# Altium project Midi Stick.PrjPCB
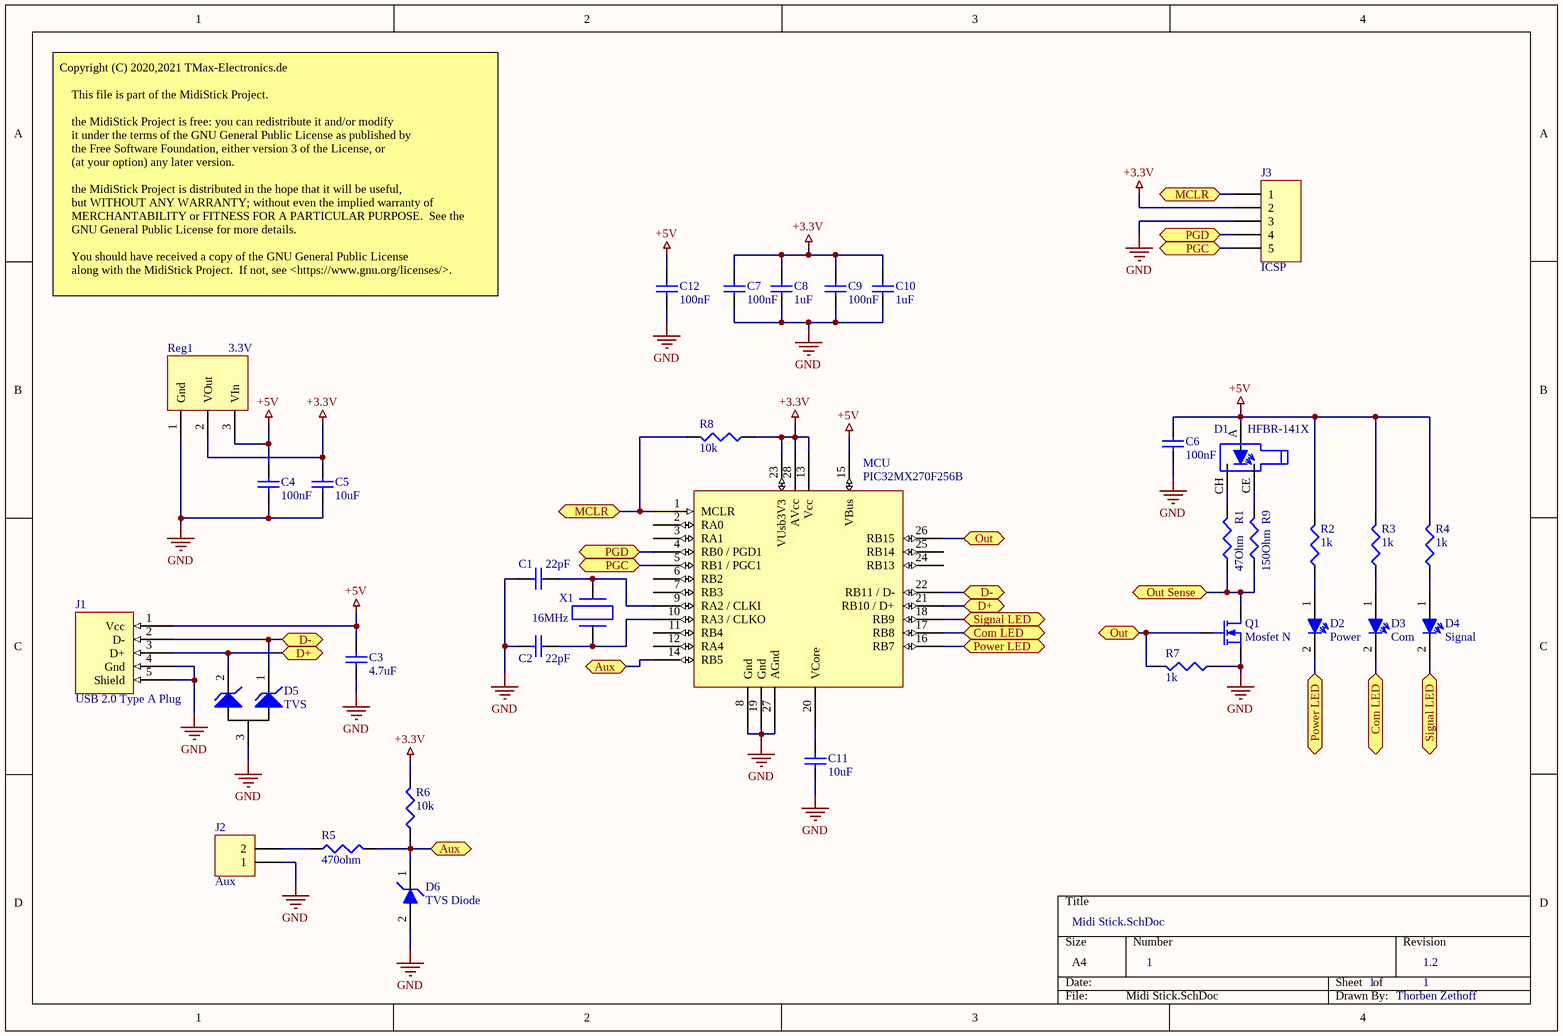
[diagram p0: Midi Stick.SchDoc]
Version: 1.2; Manager: Thorben Zethoff
1 sheet, 34 parts. Net scope: flat (ports and power ports of the same name join across sheets).
Board file: Midi Stick.PcbDoc

## Sheet Midi Stick.SchDoc
size A4

### Parts
C1  22pF  [0603]
C2  22pF  [0603]
C3  4.7uF  [0603]
C4  100nF  [0603]
C5  10uF  [0603]
C6  100nF  [0402]
C7  100nF  [0603]
C8  1uF  [0603]
C9  100nF  [0603]
C10  1uF  [0603]
C11  10uF  [0603]
C12  100nF  [0603]
D1  HFBR-141X  [HFBR-1414MZ]
D2  Power  [0603]
D3  Com  [0603]
D4  Signal  [0603]
D5  TVS  [sot 23]
D6  TVS Diode  [SOD523]
J1  USB 2.0 Type A Plug  [USB 2.0 TYPE A PLUG]
J2  Aux  [HDR1X2]
J3  ICSP  [HDR1X5]
MCU  PIC32MX270F256B  [TSSOP28_Wide]
Q1  Mosfet N  [sot 23]
R1  47Ohm  [0603]
R2  1k  [0603]
R3  1k  [0603]
R4  1k  [0603]
R5  470ohm  [0603]
R6  10k  [0603]
R7  1k  [0603]
R8  10k  [0603]
R9  150Ohm  [0603]
Reg1  3.3V  [SOT223]
X1  16MHz  [ECS-3225MV Oscillator]

### Ports
Aux (bidir), Com LED (bidir), D+ (bidir), D- (bidir), MCLR (bidir), Out (bidir), Out Sense (bidir), PGC (bidir), PGD (bidir), Power LED (bidir), Signal LED (bidir)

### Nets
+3.3V: C5.2 C7.2 C8.2 C9.2 C10.2 J3.2 MCU.13(Vcc) MCU.23(VUsb3V3) MCU.28(AVcc) R6.2 R8.1 Reg1.2(VOut)
+5V: C3.2 C4.2 C6.2 C12.2 D1.A J1.1(Vcc) MCU.15(VBus) R2.2 R3.2 R4.2 Reg1.3(VIn)
GND: C1.1 C2.1 C3.1 C4.1 C5.1 C6.1 C7.1 C8.1 C9.1 C10.1 C11.1 C12.1 D5.3 D6.2 J1.4(Gnd) J1.5(Shield) J2.1 J3.3 MCU.8(Gnd) MCU.19(Gnd) MCU.27(AGnd) Q1.S R7.1 Reg1.1(Gnd)
NetC1_2: C1.2 MCU.9(RA2_/_CLKI) X1.2
NetC2_2: C2.2 MCU.10(RA3_/_CLKO) X1.1
NetC11_2: C11.2 MCU.20(VCore)
NetD1_CE: D1.CE R9.2
NetD1_CH: D1.CH R1.2
NetD2_1: D2.1 R2.1
NetD2_2: D2.2 MCU.16(RB7) ; port Power LED
NetD3_1: D3.1 R3.1
NetD3_2: D3.2 MCU.17(RB8) ; port Com LED
NetD4_1: D4.1 R4.1
NetD4_2: D4.2 MCU.18(RB9) ; port Signal LED
NetD5_1: D5.1 J1.2(D-) MCU.22(RB11_/_D-) ; port D-
NetD5_2: D5.2 J1.3(D+) MCU.21(RB10_/_D+) ; port D+
NetD6_1: D6.1 MCU.14(RB5) R5.2 R6.1 ; port Aux
NetJ2_2: J2.2 R5.1
NetJ3_1: J3.1 MCU.1(MCLR) R8.2 ; port MCLR
NetJ3_4: J3.4 MCU.4(RB0_/_PGD1) ; port PGD
NetJ3_5: J3.5 MCU.5(RB1_/_PGC1) ; port PGC
NetMCU_26: MCU.26(RB15) Q1.G R7.2 ; port Out
NetQ1_D: Q1.D R1.1 R9.1 ; port Out Sense

Not connected (* = marked no-connect by the designer): MCU 2(RA0) 3(RA1) 6(RB2) 7(RB3) 11(RB4) 12(RA4) 24(RB13) 25(RB14)

### Notes on the sheet
- Copyright (C) 2020,2021 TMax-Electronics.de
  This file is part of the MidiStick Project.
  the MidiStick Project is free: you can redistribute it and/or modify
  it under the terms of the GNU General Public License as published by
  the Free Software Foundation, either version 3 of the License, or
  (at your option) any later version.
  the MidiStick Project is distributed in the hope that it will be useful,
  but WITHOUT ANY WARRANTY; without even the implied warranty of
  MERCHANTABILITY or FITNESS FOR A PARTICULAR PURPOSE.  See the
  GNU General Public License for more details.
  You should have received a copy of the GNU General Public License
  along with the MidiStick Project.  If not, see <https://www.gnu.org/licenses/>.
- 1

### Library data of the parts
C1-C12 = Cap: Supplier 1: Digi-Key; Supplier 2: Digi-Key; Supplier 3: Digi-Key; Supplier Part Number 1: 1276-2044-1-ND; Supplier Part Number 2: 1276-1018-1-ND; Supplier Part Number 3: 1276-1182-1-ND; Supplier 4: Digi-Key; Supplier 5: Digi-Key; Supplier 6: Digi-Key; Supplier 7: Digi-Key; Supplier 8: Digi-Key; Supplier 9: Digi-Key; Supplier Part Number 4: 1276-1009-1-ND; Supplier Part Number 5: 1276-1098-1-ND; Supplier Part Number 6: 1276-1119-1-ND; Supplier Part Number 7: 490-12737-1-ND; Supplier Part Number 9: 587-1249-1-ND; Supplier Part Number 8: 1276-1183-1-ND; Supplier 10: Digi-Key; Supplier 11: Digi-Key; Supplier 12: Digi-Key; Supplier 13: Digi-Key; Supplier Part Number 10: 1276-CL10B104KB8NNNLCT-ND; Supplier Part Number 11: 399-1085-1-ND; Supplier Part Number 13: 587-2985-1-ND; Supplier Part Number 12: 1276-1021-1-ND; Supplier 14: Digi-Key; Supplier 15: Digi-Key; Supplier 16: Digi-Key; Supplier 17: Digi-Key; Supplier 18: Digi-Key; Supplier 19: Digi-Key; Supplier Part Number 14: 490-14603-1-ND; Supplier Part Number 15: 311-3700-1-ND; Supplier Part Number 16: 311-1042-1-ND; Supplier Part Number 17: 311-1415-1-ND; Supplier Part Number 19: 587-4321-1-ND; Supplier Part Number 18: 1276-1907-1-ND; Supplier 20: Digi-Key; Supplier 21: Digi-Key; Supplier 22: Digi-Key; Supplier Part Number 20: 1276-6767-1-ND; Supplier Part Number 21: 1276-7060-1-ND; Supplier Part Number 22: 311-1084-1-ND
D1 = HFBR-141X: Fiber optic transmitter. ST connector; Supplier 1: Digi-Key; Supplier Part Number 1: 516-2038-ND
D2-D4 = LED: Supplier 1: Digi-Key; Supplier 2: Digi-Key; Supplier 3: Digi-Key; Supplier 4: Digi-Key; Supplier Part Number 1: 732-4979-1-ND; Supplier Part Number 2: 732-4971-1-ND; Supplier Part Number 3: 732-4966-1-ND; Supplier Part Number 4: 732-4981-1-ND
D5 = dual TVS Diode: Supplier 1: Digi-Key; Supplier Part Number 1: 1727-3936-1-ND
J2 = Header 2: Header, 2-Pin; LatestRevisionDate: 17-Jul-2002; LatestRevisionNote: Re-released for DXP Platform.; Publisher: Altium Limited
J3 = Header 5: Header, 5-Pin; LatestRevisionDate: 17-Jul-2002; LatestRevisionNote: Re-released for DXP Platform.; Publisher: Altium Limited
MCU = PIC32MX2xxFxxxB: 32Bit pic with usb; Supplier 1: Digi-Key; Supplier Part Number 1: PIC32MX270F256B-I/SS-ND
Q1 = Mosfet N: pin to pad: D>3 G>1 S>2; Supplier 1: Digi-Key; Supplier Part Number 1: 1727-5305-1-ND; Supplier 2: Digi-Key; Supplier Part Number 2: 1727-1123-1-ND; Supplier 3: Digi-Key; Supplier 4: Digi-Key; Supplier Part Number 4: T2N7002AKLMCT-ND; Supplier Part Number 3: BSC0906NSATMA1CT-ND; Supplier 5: Digi-Key; Supplier Part Number 5: 1727-4714-1-ND
R1-R9 = Resistor: Supplier 1: Digi-Key; Supplier 2: Digi-Key; Supplier Part Number 1: RHM10DCT-ND; Supplier Part Number 2: 696-1834-1-ND; Supplier 3: Digi-Key; Supplier 4: Digi-Key; Supplier 5: Digi-Key; Supplier 6: Digi-Key; Supplier 7: Digi-Key; Supplier Part Number 3: RMCF0603JT3K90CT-ND; Supplier Part Number 5: RHM100DCT-ND; Supplier Part Number 6: RMCF0603FT54K9CT-ND; Supplier Part Number 7: RMCF0603FT40K2CT-ND; Supplier Part Number 4: RHM1.0KDCT-ND; Supplier 8: Digi-Key; Supplier 9: Digi-Key; Supplier 10: Digi-Key; Supplier 11: Digi-Key; Supplier Part Number 10: 311-200JRCT-ND; Supplier Part Number 11: 311-300JRCT-ND; Supplier Part Number 8: P200LCT-ND; Supplier Part Number 9: 311-1.0KJRCT-ND; Supplier 12: Digi-Key; Supplier 13: Digi-Key; Supplier 14: Digi-Key; Supplier 15: Digi-Key; Supplier 16: Digi-Key; Supplier 17: Digi-Key; Supplier Part Number 12: YAG3356CT-ND; Supplier Part Number 13: 311-220GRCT-ND; Supplier Part Number 14: 311-220KGRCT-ND; Supplier Part Number 15: 311-1.0KGRCT-ND; Supplier Part Number 16: 311-200KHRCT-ND; Supplier Part Number 17: A102451-ND; Supplier 18: Digi-Key; Supplier Part Number 18: 311-2.00KHRCT-ND; Supplier 19: Digi-Key; Supplier Part Number 19: 311-10KGRCT-ND; Supplier 20: Digi-Key; Supplier 21: Digi-Key; Supplier 22: Digi-Key; Supplier 23: Digi-Key; Supplier 24: Digi-Key; Supplier 25: Digi-Key; Supplier 26: Digi-Key; Supplier 27: Digi-Key; Supplier 28: Digi-Key; Supplier 29: Digi-Key; Supplier Part Number 29: 311-499KLRCT-ND; Supplier Part Number 28: 311-200KJRCT-ND; Supplier Part Number 26: YAG3226CT-ND; Supplier Part Number 20: 311-1.00LRCT-ND; Supplier Part Number 25: 311-12KJRCT-ND; Supplier Part Number 24: 311-10.0KLRCT-ND; Supplier Part Number 23: 311-4.7KJRCT-ND; Supplier Part Number 22: 311-2.2KJRCT-ND; Supplier Part Number 21: 311-220JRCT-ND; Supplier Part Number 27: 311-75KJRCT-ND; Supplier 30: Digi-Key; Supplier 31: Digi-Key; Supplier 32: Digi-Key; Supplier Part Number 32: 541-3127-6-ND; Supplier Part Number 31: 696-1677-1-ND; Supplier Part Number 30: YAG6087CT-ND; Supplier 33: Digi-Key; Supplier 34: Digi-Key; Supplier 35: Digi-Key; Supplier 36: Digi-Key; Supplier 37: Digi-Key; Supplier 38: Digi-Key; Supplier 39: Digi-Key; Supplier 40: Digi-Key; Supplier 41: Digi-Key; Supplier 42: Arrow; Supplier Part Number 33: 311-47.0HRCT-ND; Supplier Part Number 34: 311-470HRCT-ND; Supplier Part Number 37: 311-5.23KHRCT-ND; Supplier Part Number 36: 311-100KGRCT-ND; Supplier Part Number 35: 311-470KGRCT-ND; Supplier Part Number 38: 311-52.3KHRCT-ND; Supplier Part Number 39: 311-22KGRCT-ND; Supplier Part Number 41: 311-7.15KHRCT-ND; Supplier Part Number 42: RC0603FR-072K2L; Supplier Part Number 40: 311-15.8KHRCT-ND
Reg1 = VReg
X1 = Quarz crystal: pin to pad: 1>2 2>4; Supplier 1: Digi-Key; Supplier Part Number 1: SER4069TR-ND
D6 = TVS Diode: Supplier 1: Digi-Key; Supplier Part Number 1: UCLAMP3301HCT-ND
J1 = USB 2.0 Type A Plug: Supplier Part Number 1: 102-3996-ND; Supplier 1: Digi-Key